# EAGLE design SparkFun_ProtoShield_Kit_rev31 (EAGLE 7.7.0)
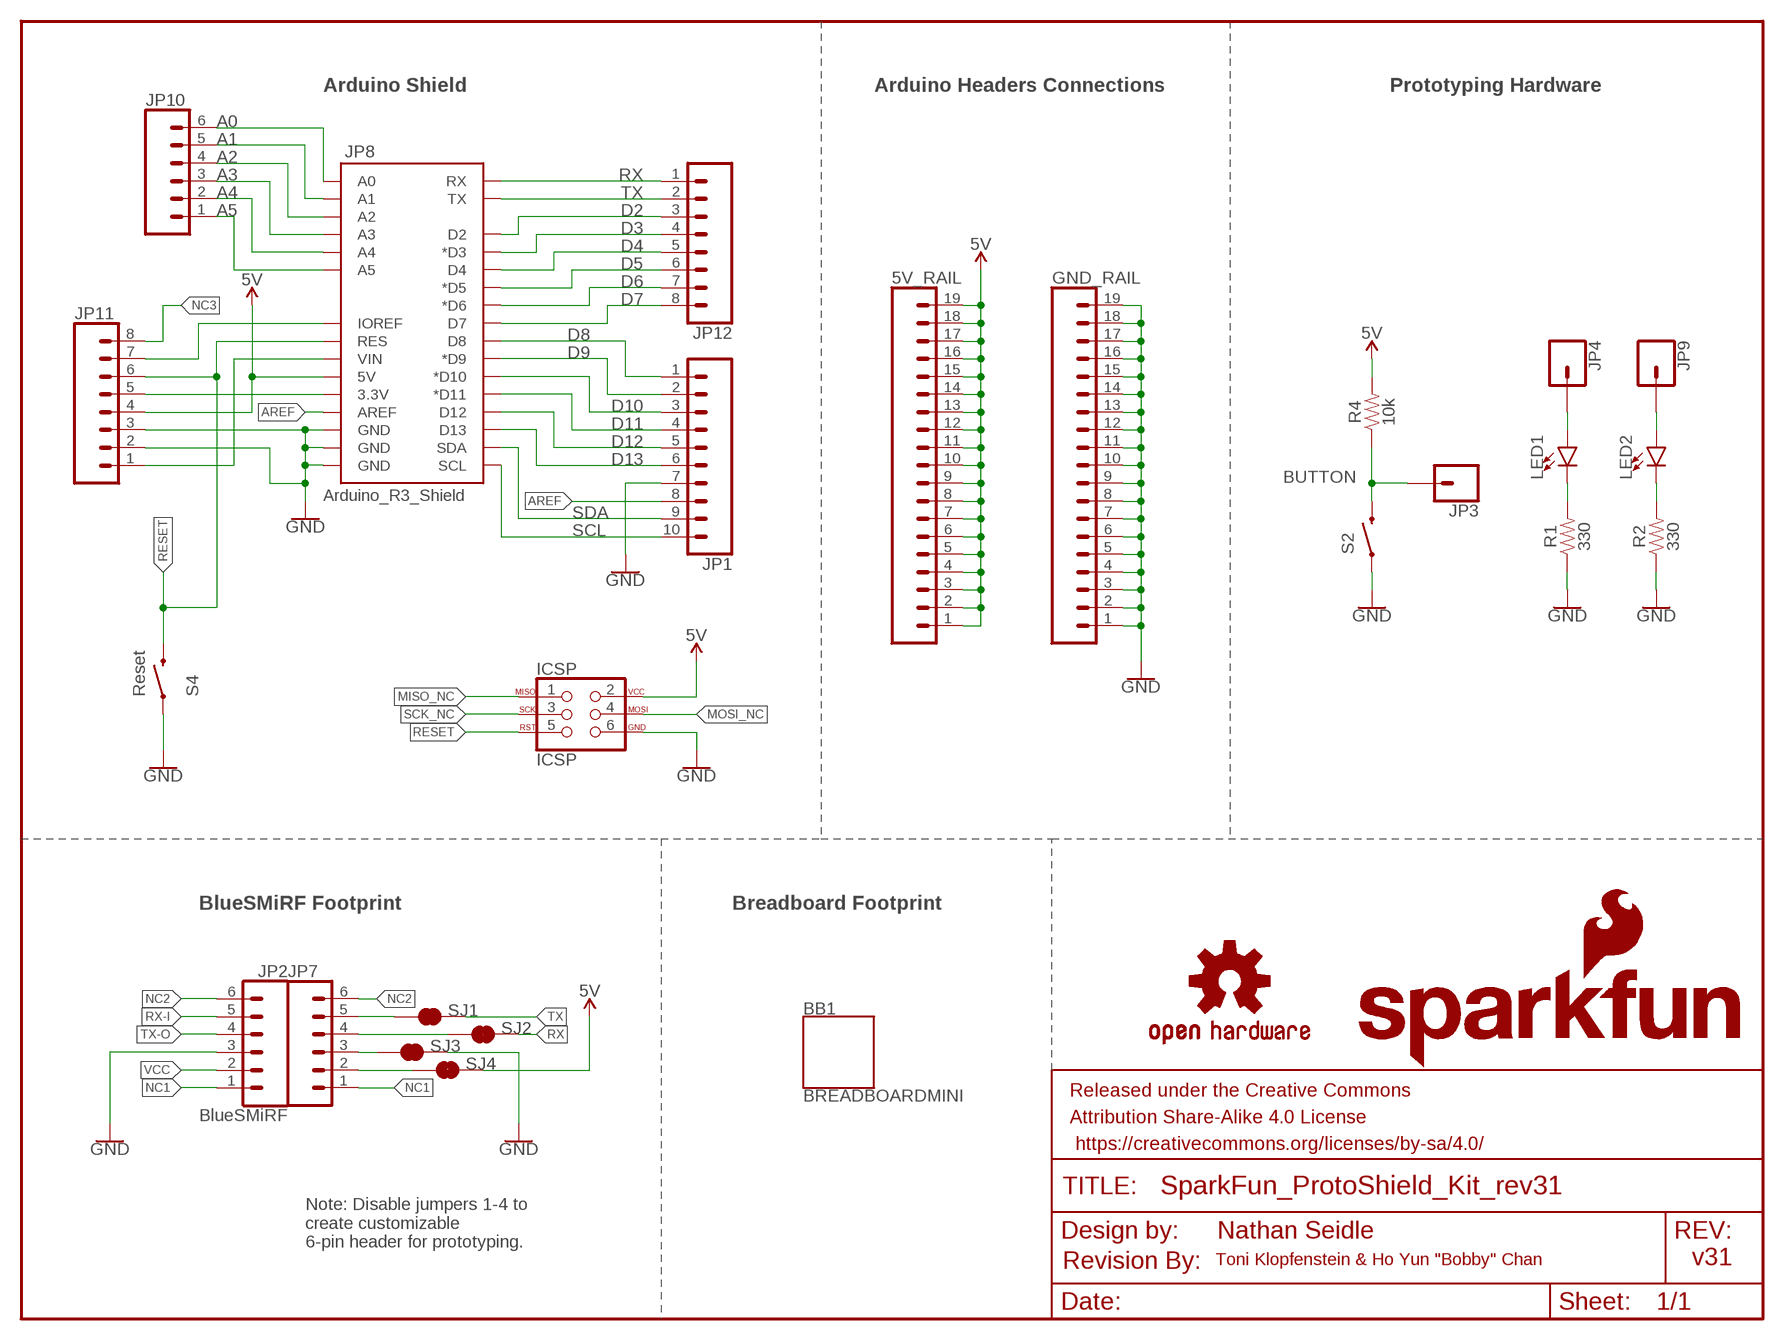
[diagram p0: schematic, sheet 1]

## Parts
5V_RAIL  CONN_19  [1X19]
BB1  BREADBOARDMINI  [BREADBOARD-MINI]
FRAME1  FRAME-LETTER  [CREATIVE_COMMONS]
GND_RAIL  CONN_19  [1X19]
ICSP  ICSP  AVR_SPI_PROG_3X2PTH  [2X3]
JP1  CONN_10"  [1X10]
JP2  BlueSMiRF  CONN_06SILK_FEMALE_PTH  [1X06]
JP3  CONN_01  [1X01]
JP4  CONN_01  [1X01]
JP7  CONN_06SILK_FEMALE_PTH  [1X06]
JP8  ARDUINO_R3_SHIELDR3_PROTO_SHIELD  [UNO_R3_PROTO_SHIELD]
JP9  CONN_01  [1X01]
JP10  CONN_06SILK_FEMALE_PTH  [1X06]
JP11  CONN_08"  [1X08]
JP12  CONN_08"  [1X08]
LED1  LED3MM  [LED_3MM]
LED2  LED3MM  [LED_3MM]
LOGO1  OSHW-LOGOS  [OSHW-LOGO-S]
R1  330  330OHM-HORIZ-1/10W-5%  [AXIAL-0.3]
R2  330  330OHM-HORIZ-1/10W-5%  [AXIAL-0.3]
R4  10k  10KOHM-HORIZ-1/4W-5%  [AXIAL-0.3]
S2  MOMENTARY-SWITCH-SPST-PTH-6.0MM-KIT  [TACTILE_SWITCH_PTH_6.0MM_KIT]
S4  MOMENTARY-SWITCH-SPST-PTH-6.0MM-KIT  [TACTILE_SWITCH_PTH_6.0MM_KIT]
SJ1  JUMPER-SMT_2_NC_TRACE_SILK  [SMT-JUMPER_2_NC_TRACE_SILK]
SJ2  JUMPER-SMT_2_NC_TRACE_SILK  [SMT-JUMPER_2_NC_TRACE_SILK]
SJ3  JUMPER-SMT_2_NC_TRACE_SILK  [SMT-JUMPER_2_NC_TRACE_SILK]
SJ4  JUMPER-SMT_2_NC_TRACE_SILK  [SMT-JUMPER_2_NC_TRACE_SILK]
U$1  SFE_LOGO_NAME_FLAME.1_INCH  [SFE_LOGO_NAME_FLAME_.1]
U$2  REVISION  [REVISION]

## Nets
3.3: JP8.3.3V JP11.5
5V [power]: 5V_RAIL.1 5V_RAIL.2 5V_RAIL.3 5V_RAIL.4 5V_RAIL.5 5V_RAIL.6 5V_RAIL.7 5V_RAIL.8 5V_RAIL.9 5V_RAIL.10 5V_RAIL.11 5V_RAIL.12 5V_RAIL.13 5V_RAIL.14 5V_RAIL.15 5V_RAIL.16 5V_RAIL.17 5V_RAIL.18 5V_RAIL.19 ICSP.2 JP8.5V JP11.4 R4.P$2 SJ4.2
A0: JP8.A0 JP10.6
A1: JP8.A1 JP10.5
A2: JP8.A2 JP10.4
A3: JP8.A3 JP10.3
A4: JP8.A4 JP10.2
A5: JP8.A5 JP10.1
AREF: JP1.8 JP8.AREF
BUTTON: JP3.1 R4.P$1 S2.3
D2: JP8.D2 JP12.3
D3: JP8.D3(*D3) JP12.4
D4: JP8.D4 JP12.5
D5: JP8.D5(*D5) JP12.6
D6: JP8.D6(*D6) JP12.7
D7: JP8.D7 JP12.8
D8: JP1.1 JP8.D8
D9: JP1.2 JP8.D9(*D9)
D10: JP1.3 JP8.D10(*D10)
D11: JP1.4 JP8.D11(*D11)
D12: JP1.5 JP8.D12
D13: JP1.6 JP8.D13
GND [power]: GND_RAIL.1 GND_RAIL.2 GND_RAIL.3 GND_RAIL.4 GND_RAIL.5 GND_RAIL.6 GND_RAIL.7 GND_RAIL.8 GND_RAIL.9 GND_RAIL.10 GND_RAIL.11 GND_RAIL.12 GND_RAIL.13 GND_RAIL.14 GND_RAIL.15 GND_RAIL.16 GND_RAIL.17 GND_RAIL.18 GND_RAIL.19 ICSP.6 JP1.7 JP2.3 JP7.3 JP8.GND@0(GND) JP8.GND@1(GND) JP8.GND@2(GND) JP11.2 JP11.3 R1.P$1 R2.P$1 S2.1 S4.1 SJ3.1 SJ3.2
LED1: JP4.1 LED1.A
LED2: JP9.1 LED2.A
MISO_NC: ICSP.1
MOSI_NC: ICSP.4
N$1: JP8.IOREF JP11.7
N$6: LED1.K(C) R1.P$2
N$7: LED2.K(C) R2.P$2
NC1: JP2.1 JP7.1
NC2: JP2.6 JP7.6
NC3: JP11.8
RESET: ICSP.5 JP8.RES JP11.6 S4.3
RX: JP8.RX JP12.1 SJ2.2
RX-I: JP2.5 JP7.5 SJ1.1
SCK_NC: ICSP.3
SCL: JP1.10 JP8.SCL
SDA: JP1.9 JP8.SDA
TX: JP8.TX JP12.2 SJ1.2
TX-O: JP2.4 JP7.4 SJ2.1
VCC: JP2.2 JP7.2 SJ4.1
VIN: JP8.VIN JP11.1

## Notes on the sheet
- Arduino Shield | Arduino Headers Connections | Prototyping Hardware
- A0
- A1
- A2
- A3
- A4
- A5
- Arduino_R3_Shield
- Reset
- BlueSMiRF Footprint | Breadboard Footprint
- Nathan Seidle
- Note: Disable jumpers 1-4 to 
  create customizable 
  6-pin header for prototyping.
- Toni Klopfenstein & Ho Yun "Bobby" Chan | v31

## Library data of the parts
5V_RAIL GND_RAIL = SparkFun-Connectors:CONN_19: Multi connection point. Often used as Generic Header-pin footprint for 0.1 inch spaced/style header connections On any of the 0.1 inch spaced packages, you can populate with these: Break Away Headers - Straight <https://www.sparkfun.com/products/116> (PRT-00116) Break Away Male Headers - Right Angle <https://www.sparkfun.com/products/553> (PRT-00553) Female Headers <https://www.sparkfun.com/products/115> (PRT-00115) Break Away Headers - Machine Pin <https://www.sparkfun.com/products/117> (PRT-00117) Break Away Female Headers - Swiss Machine Pin <https://www.sparkfun.com/products/743> (PRT-00743) For SCREWTERMINALS and SPRING TERMINALS visit here: Screw Terimnals on SparkFun.com <https://www.sparkfun.com/search/results?term=Screw+Terminals> (5mm/3.5mm/2.54mm spacing) This device is also useful as a general connection point to wire up your design to another part of your project. Our various solder wires solder well into these plated through hole pads. Hook-Up Wire - Assortment (Stranded, 22 AWG) <https://www.sparkfun.com/products/11375> (PRT-11375) Hook-Up Wire - Assortment (Solid Core, 22 AWG) <https://www.sparkfun.com/products/11367> (PRT-11367) View the entire wire category on our website here <https://www.sparkfun.com/categories/141> Special notes: Molex polarized connector foot print use with SKU : PRT-08231 with associated crimp pins and housings. 1MM SMD Version SKU: PRT-10208 NOTES ON THE VARIANTS LOCK and LOCK_LONGPADS... This footprint was designed to help hold the alignment of a through-hole component (i.e. 6-pin header) while soldering it into place. You may notice that each hole has been shifted either up or down by 0.005 of an inch from it's more standard position (which is a perfectly straight line). This slight alteration caused the pins (the squares in the middle) to touch the edges of the holes. Because they are alternating, it causes a "brace" to hold the component in place. 0.005 has proven to be the perfect amount of "off-center" position when using our standard breakaway headers. Although looks a little odd when you look at the bare footprint, once you have a header in there, the alteration is very hard to notice. Also,if you push a header all the way into place, it is covered up entirely on the bottom side.
BB1 = SparkFun-Boards:BREADBOARD: SparkFun Breadboard Mini This is the mechnical outline for the very small self adhesive breadboard from SparkFun Electronics and our prototyping breadboard of the same size. Good for very small proto areas. SparkFun Products: White <https://www.sparkfun.com/products/7916> Green <https://www.sparkfun.com/products/12046> Black <https://www.sparkfun.com/products/12047> Red <https://www.sparkfun.com/products/12044> Blue <https://www.sparkfun.com/products/12045> SparkFun Solder-able Breadboard-Mini <https://www.sparkfun.com/products/12702>; PROD_ID: COMP-12034
FRAME1 = SparkFun-Aesthetics:FRAME-LETTER: Schematic Frame Standard 8.5x11 US Letter frame
ICSP = SparkFun-Connectors:AVR_SPI_PROG_3X2: AVR ISP 6 Pin This is the reduced ISP connector for AVR programming. Common on Arduino. This footprint will take up less PCB space and can be used with a 10-pin to 6-pin adapter such as SKU: BOB-08508 **Special note about "TEST_POINT" package. The stop mask is on the top side, so if you want your programming test points to be on the bottom of your board, make sure to place this package on the bottom side of the board. This also ensure that the orientation to program from the bottom side will be correct. SparkFun Products: SparkFun ISP Pogo Adapter <https://www.sparkfun.com/products/11591> - NS Tiny AVR Programmer <https://www.sparkfun.com/products/11801> -PTH
JP1 = SparkFun-Connectors:CONN_10: Multi connection point. Often used as Generic Header-pin footprint for 0.1 inch spaced/style header connections On any of the 0.1 inch spaced packages, you can populate with these: Break Away Headers - Straight <https://www.sparkfun.com/products/116> (PRT-00116) Break Away Male Headers - Right Angle <https://www.sparkfun.com/products/553> (PRT-00553) Female Headers <https://www.sparkfun.com/products/115> (PRT-00115) Break Away Headers - Machine Pin <https://www.sparkfun.com/products/117> (PRT-00117) Break Away Female Headers - Swiss Machine Pin <https://www.sparkfun.com/products/743> (PRT-00743) Arduino Stackable Header - 10 Pin <https://www.sparkfun.com/products/11376> (PRT-11376) For SCREWTERMINALS and SPRING TERMINALS visit here: Screw Terimnals on SparkFun.com <https://www.sparkfun.com/search/results?term=Screw+Terminals> (5mm/3.5mm/2.54mm spacing) This device is also useful as a general connection point to wire up your design to another part of your project. Our various solder wires solder well into these plated through hole pads. Hook-Up Wire - Assortment (Stranded, 22 AWG) <https://www.sparkfun.com/products/11375> (PRT-11375) Hook-Up Wire - Assortment (Solid Core, 22 AWG) <https://www.sparkfun.com/products/11367> (PRT-11367) View the entire wire category on our website here <https://www.sparkfun.com/categories/141> Special notes: Molex polarized connector foot print use with SKU : PRT-08231 with associated crimp pins and housings. 1MM SMD Version SKU: PRT-10208 NOTES ON THE VARIANTS LOCK and LOCK_LONGPADS... This footprint was designed to help hold the alignment of a through-hole component (i.e. 6-pin header) while soldering it into place. You may notice that each hole has been shifted either up or down by 0.005 of an inch from it's more standard position (which is a perfectly straight line). This slight alteration caused the pins (the squares in the middle) to touch the edges of the holes. Because they are alternating, it causes a "brace" to hold the component in place. 0.005 has proven to be the perfect amount of "off-center" position when using our standard breakaway headers. Although looks a little odd when you look at the bare footprint, once you have a header in there, the alteration is very hard to notice. Also,if you push a header all the way into place, it is covered up entirely on the bottom side.; PROD_ID: CONN-11563
JP2 JP7 JP10 = SparkFun-Connectors:CONN_06: Multi connection point. Often used as Generic Header-pin footprint for 0.1 inch spaced/style header connections On any of the 0.1 inch spaced packages, you can populate with these: Break Away Headers - Straight <https://www.sparkfun.com/products/116> (PRT-00116) Break Away Male Headers - Right Angle <https://www.sparkfun.com/products/553> (PRT-00553) Female Headers <https://www.sparkfun.com/products/115> (PRT-00115) Break Away Headers - Machine Pin <https://www.sparkfun.com/products/117> (PRT-00117) Break Away Female Headers - Swiss Machine Pin <https://www.sparkfun.com/products/743> (PRT-00743) Arduino Stackable Header - 6 Pin <https://www.sparkfun.com/products/9280> (PRT-09280) For SCREWTERMINALS and SPRING TERMINALS visit here: Screw Terimnals on SparkFun.com <https://www.sparkfun.com/search/results?term=Screw+Terminals> (5mm/3.5mm/2.54mm spacing) This device is also useful as a general connection point to wire up your design to another part of your project. Our various solder wires solder well into these plated through hole pads. Hook-Up Wire - Assortment (Stranded, 22 AWG) <https://www.sparkfun.com/products/11375> (PRT-11375) Hook-Up Wire - Assortment (Solid Core, 22 AWG) <https://www.sparkfun.com/products/11367> (PRT-11367) View the entire wire category on our website here <https://www.sparkfun.com/categories/141>; PROD_ID: CONN-08437
JP3 JP4 JP9 = SparkFun-Connectors:CONN_01: Single connection point. Often used as Generic Header-pin footprint for 0.1 inch spaced/style header connections On any of the 0.1 inch spaced packages, you can populate with these: Break Away Headers - Straight <https://www.sparkfun.com/products/116> (PRT-00116) Break Away Male Headers - Right Angle <https://www.sparkfun.com/products/553> (PRT-00553) Female Headers <https://www.sparkfun.com/products/115> (PRT-00115) Break Away Headers - Machine Pin <https://www.sparkfun.com/products/117> (PRT-00117) Break Away Female Headers - Swiss Machine Pin <https://www.sparkfun.com/products/743> (PRT-00743) This device is also useful as a general connection point to wire up your design to another part of your project. Our various solder wires solder well into these plated through hole pads. Hook-Up Wire - Assortment (Stranded, 22 AWG) <https://www.sparkfun.com/products/11375> (PRT-11375) Hook-Up Wire - Assortment (Solid Core, 22 AWG) <https://www.sparkfun.com/products/11367> (PRT-11367) View the entire wire category on our website here <https://www.sparkfun.com/categories/141> Special notes: SMTSO-256-ET is a "flush mount" nut for a 4-40 screw. We mostly use this on specialty testbeds; it is a nice way to connect hardware to your PCB at an adjustable hieght. Also note, the SNAP packages are for using a snappable style connector. We sell a baggie of snaps and they are also used on two LilyPad designs: Snap Assortment - 30 pack (male and female) <https://www.sparkfun.com/products/11347> (DEV-11347) LilyPad Arduino SimpleSnap <https://www.sparkfun.com/products/10941> (DEV-10941) LilyPad SimpleSnap Protoboard <https://www.sparkfun.com/products/10940> (DEV-10940)
JP8 = TempLibrary:ARDUINO_R3_SHIELD: Shield form compatible with the Arduino Uno R3.
JP11 JP12 = SparkFun-Connectors:CONN_08: Multi connection point. Often used as Generic Header-pin footprint for 0.1 inch spaced/style header connections On any of the 0.1 inch spaced packages, you can populate with these: Break Away Headers - Straight <https://www.sparkfun.com/products/116> (PRT-00116) Break Away Male Headers - Right Angle <https://www.sparkfun.com/products/553> (PRT-00553) Female Headers <https://www.sparkfun.com/products/115> (PRT-00115) Break Away Headers - Machine Pin <https://www.sparkfun.com/products/117> (PRT-00117) Break Away Female Headers - Swiss Machine Pin <https://www.sparkfun.com/products/743> (PRT-00743) Arduino Stackable Header - 8 Pin <https://www.sparkfun.com/products/9279> (PRT-09279) For SCREWTERMINALS and SPRING TERMINALS visit here: Screw Terimnals on SparkFun.com <https://www.sparkfun.com/search/results?term=Screw+Terminals> (5mm/3.5mm/2.54mm spacing) This device is also useful as a general connection point to wire up your design to another part of your project. Our various solder wires solder well into these plated through hole pads. Hook-Up Wire - Assortment (Stranded, 22 AWG) <https://www.sparkfun.com/products/11375> (PRT-11375) Hook-Up Wire - Assortment (Solid Core, 22 AWG) <https://www.sparkfun.com/products/11367> (PRT-11367) View the entire wire category on our website here <https://www.sparkfun.com/categories/141> Special notes: Molex polarized connector foot print use with SKU : PRT-08231 with associated crimp pins and housings. 1MM SMD Version SKU: PRT-10208 NOTES ON THE VARIANTS LOCK and LOCK_LONGPADS... This footprint was designed to help hold the alignment of a through-hole component (i.e. 6-pin header) while soldering it into place. You may notice that each hole has been shifted either up or down by 0.005 of an inch from it's more standard position (which is a perfectly straight line). This slight alteration caused the pins (the squares in the middle) to touch the edges of the holes. Because they are alternating, it causes a "brace" to hold the component in place. 0.005 has proven to be the perfect amount of "off-center" position when using our standard breakaway headers. Although looks a little odd when you look at the bare footprint, once you have a header in there, the alteration is very hard to notice. Also,if you push a header all the way into place, it is covered up entirely on the bottom side.; PROD_ID: CONN-08438
LED1 LED2 = SparkFun-LED:LED: LED (Generic) Standard schematic elements and footprints for 5mm, 3mm, 1206, and 0603 sized LEDs. Generic LEDs with no color specified.; PROD_ID: DIO-08794
LOGO1 = SparkFun-Aesthetics:OSHW-LOGO: Open-Source Hardware (OSHW) Logo This logo indicates the piece of hardware it is found on incorporates a OSHW license and/or adheres to the definition of open source hardware found here: http://freedomdefined.org/OSHW
R1 R2 = SparkFun-Resistors:330OHM: 330Ω resistor A resistor is a passive two-terminal electrical component that implements electrical resistance as a circuit element. Resistors act to reduce current flow, and, at the same time, act to lower voltage levels within circuits. - Wikipedia; PROD_ID: RES-8371
R4 = SparkFun-Resistors:10KOHM: 10kΩ resistor A resistor is a passive two-terminal electrical component that implements electrical resistance as a circuit element. Resistors act to reduce current flow, and, at the same time, act to lower voltage levels within circuits. - Wikipedia; PROD_ID: RES-09435
S2 S4 = SparkFun-Switches:MOMENTARY-SWITCH-SPST: Momentary Switch (Pushbutton) - SPST Normally-open (NO) SPST momentary switches (buttons, pushbuttons). Variants PTH-12MM - 12mm square, through-hole Momentary Pushbutton Switch - 12mm Square <https://www.sparkfun.com/products/9190> (COM-09190) PTH-6.0MM, PTH-6.0MM-KIT - 6.0mm square, through-hole Mini Pushbutton Switch <https://www.sparkfun.com/products/97> (COM-00097) KIT package intended for soldering kit's - only one side of pads' copper is exposed. PTH-RIGHT-ANGLE-KIT - Right-angle, through-hole Right Angle Tactile Button <https://www.sparkfun.com/products/10791> - Used on SparkFun BigTime Watch Kit <https://www.sparkfun.com/products/11734> SMD-12MM - 12mm square, surface-mount Tactile Button - SMD (12mm) <https://www.sparkfun.com/products/12993> (COM-12993) Used on SparkFun PicoBoard <https://www.sparkfun.com/products/11888> SMD-4.5MM - 4.5mm Square Trackball Switch Used on SparkFun Blackberry Trackballer Breakout <https://www.sparkfun.com/products/13169> SMD-4.6MMX2.8MM - 4.60mm x 2.80mm, surface mount Used on SparkFun SAMD21 Mini Breakout <https://www.sparkfun.com/products/13664> SMD-5.2MM, SMD-5.2-REDUNDANT - 5.2mm square, surface-mount Mini Pushbutton Switch - SMD <https://www.sparkfun.com/products/8720> (COM-08720) Used on Arduino Pro Mini <https://www.sparkfun.com/products/11114> REDUNDANT package connects both switch circuits together SMD-6.0X3.5MM - 6.0 x 3.5mm, surface mount Momentary Reset Switch SMD <https://www.sparkfun.com/products/8229> (COM-08229) SMD-6.2MM-TALL - 6.2mm square, surface mount Tactile Button - SMD (6mm) <https://www.sparkfun.com/products/12992> Used on SparkFun Digital Sandbox <https://www.sparkfun.com/products/12651> SMD-RIGHT-ANGLE - Right-angle, surface mount Used on SparkFun Block for Intel® Edison - Arduino <https://www.sparkfun.com/products/13036>; PROD_ID: SWCH-08441; SF_SKU: COM-00097
SJ1-SJ4 = SparkFun-Jumpers:JUMPER-SMT_2_NC_TRACE: Normally closed trace jumper This jumper has a trace between two pads so it's normally closed (NC). Use a razor knife to open the connection. For best results follow the IPC guidelines for cutting traces: Cutout at least 0.063 mm (0.005 in). Remove all loose material to clean up the cut area. Seal the cut with an approved epoxy. Reapply solder to reclose the connection.
U$1 = SparkFun-Aesthetics:SFE_LOGO_NAME_FLAME: SparkFun Font Logo w/ Flame This is the SparkFun full logo. The logo on the schematic will always be the same size; the package variant is the height of the flame part of the logo. Default layer for the logo on the board is tSilk.
U$2 = SparkFun-Aesthetics:REVISION

## Net classes
1 power: width 0.254 mm

## Board
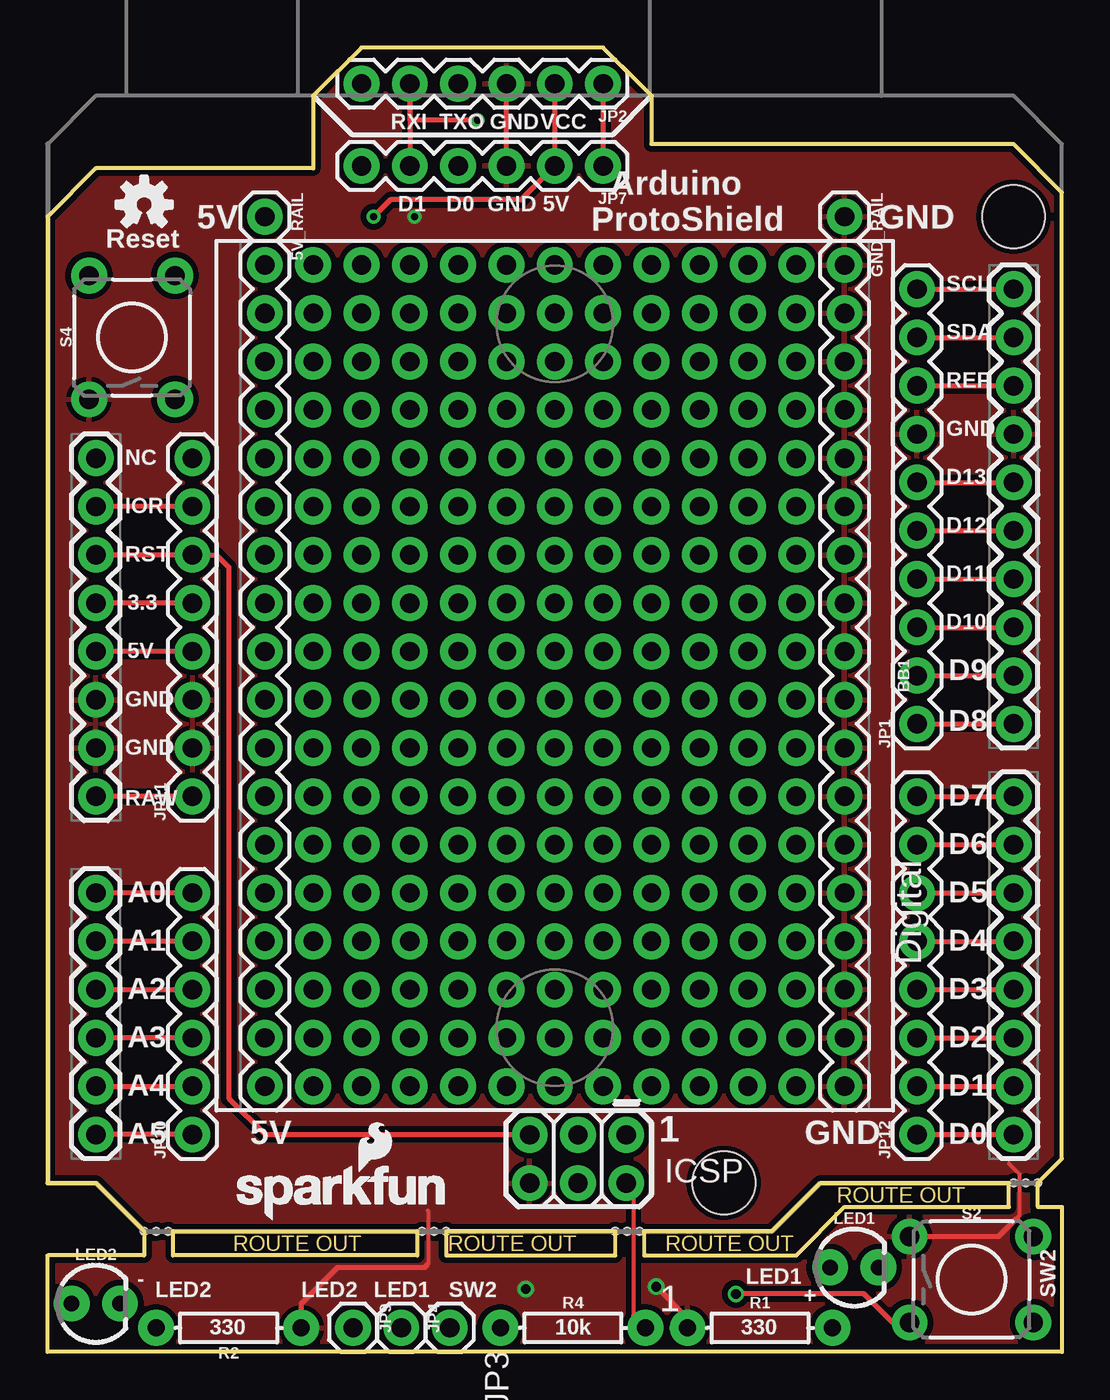
[diagram p1: board, top side]
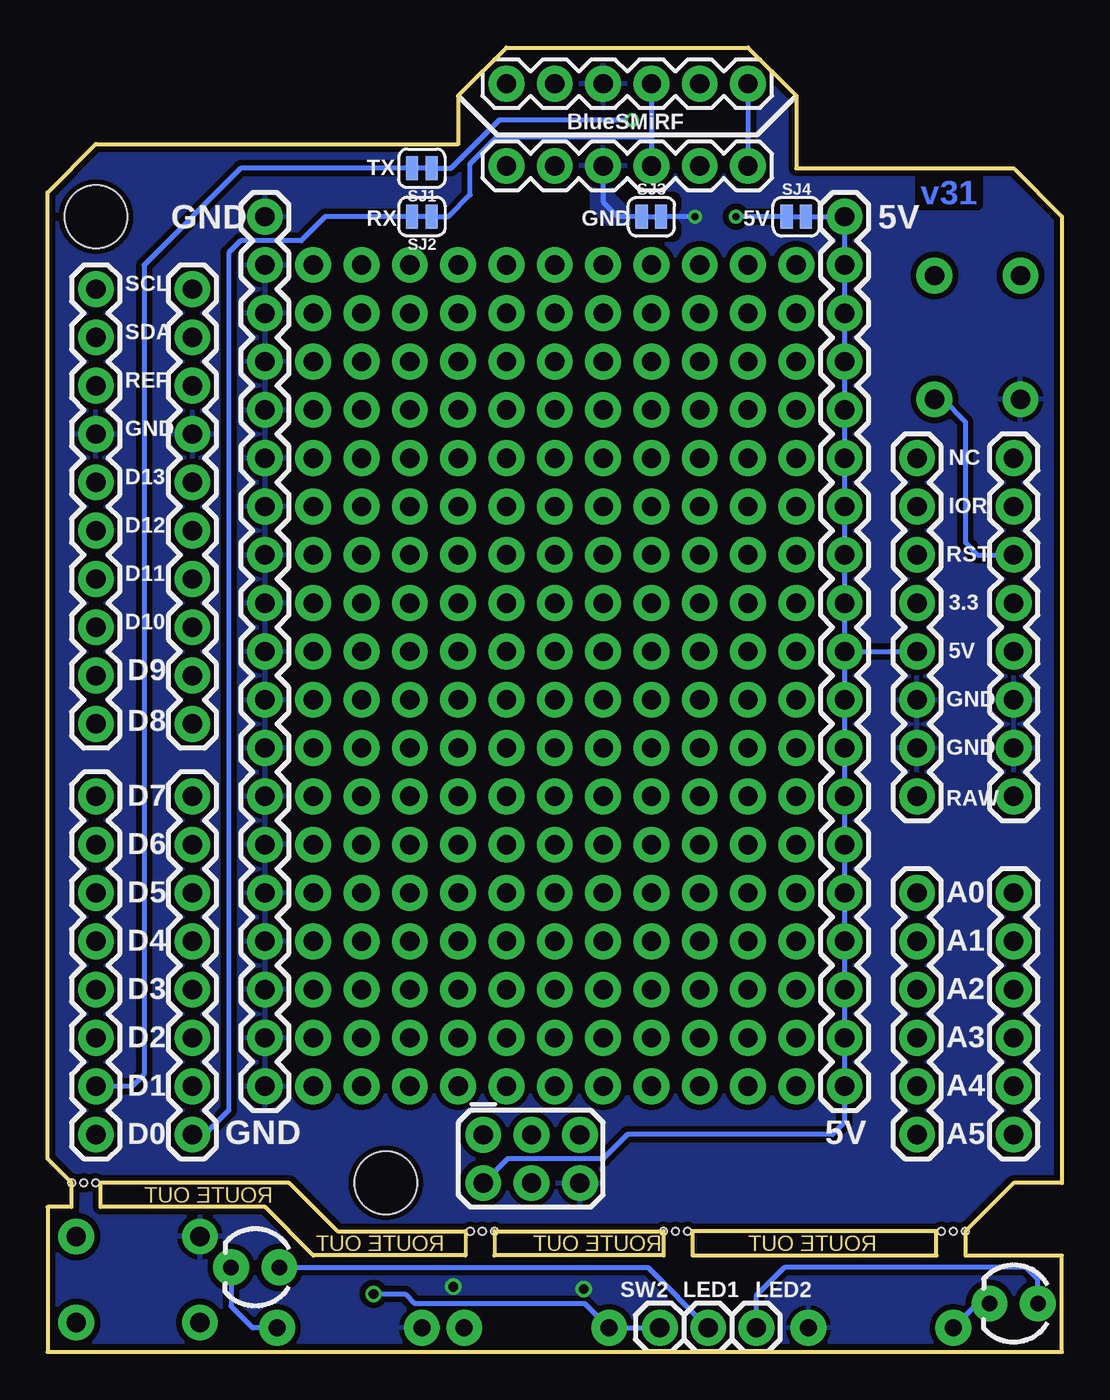
[diagram p2: board, bottom side, seen from below]

Size 53.34 x 68.58 mm. Coordinates in mm from the lower left corner, seen from the top.
Copper layers (1*16): Top 0.035mm / dielectric 1.5mm / Bottom 0.035mm
Design rules "SparkFun-2-layer-TIGHT": minimum track width 7mil, minimum drill 15mil, track to track 7mil, track to pad 7mil, pad to pad 7mil, via to via 7mil, smd to smd 7mil, copper to edge 7mil, drill to drill 7mil, minimum pad ring 7mil, minimum via ring 7mil, stop-mask expansion 4mil, vias tented up to drill 20mil, thermal gap 10mil
Holes 0.38 mm at 5.08,6.35 5.71,6.35 6.35,6.35 19.68,6.35 20.32,6.35 20.95,6.35 50.8,8.89 52.07,8.89 51.44,8.89 29.84,6.35 30.48,6.35 31.11,6.35
tRestrict: 5 lines
bRestrict: 12 lines

### Footprints (pad centres in the part's own frame; a part is rotated, then mirrored left to right if it is on the bottom)
1X19 = drill 1.016 pad 1.88: 1 0,0; 2 2.54,0; 3 5.08,0; 4 7.62,0; 5 10.16,0; 6 12.7,0; 7 15.24,0; 8 17.78,0; 9 20.32,0; 10 22.86,0; 11 25.4,0; 12 27.94,0; 13 30.48,0; 14 33.02,0; 15 35.56,0; 16 38.1,0; 17 40.64,0; 18 43.18,0; 19 45.72,0
2X3 = drill 1.016 pad 1.88: 1 0,0; 2 0,2.54; 3 2.54,0; 4 2.54,2.54; 5 5.08,0; 6 5.08,2.54
1X10 = drill 1.016 pad 1.88: 1 0,0; 2 2.54,0; 3 5.08,0; 4 7.62,0; 5 10.16,0; 6 12.7,0; 7 15.24,0; 8 17.78,0; 9 20.32,0; 10 22.86,0
1X06 = drill 1.016 pad 1.88: 1 0,0; 2 2.54,0; 3 5.08,0; 4 7.62,0; 5 10.16,0; 6 12.7,0
1X01 = drill 1.016 pad 1.88: 1 0,0
UNO_R3_PROTO_SHIELD = drill 1.016 pad 1.88: 3.3V 50.8,26.67; 5V 50.8,29.21; A0 50.8,41.91; A1 50.8,44.45; A2 50.8,46.99; A3 50.8,49.53; A4 50.8,52.07; A5 50.8,54.61; AREF 2.54,15.24; D2 2.54,49.53; D3 2.54,46.99; D4 2.54,44.45; D5 2.54,41.91; D6 2.54,39.37; D7 2.54,36.83; D8 2.54,33.02; D9 2.54,30.48; D10 2.54,27.94; D11 2.54,25.4; D12 2.54,22.86; D13 2.54,20.32; GND@0 50.8,31.75; GND@1 50.8,34.29; GND@2 2.54,17.78; IOREF 50.8,21.59; NC 50.8,19.05; RES 50.8,24.13; RX 2.54,54.61; SCL 2.54,10.16; SDA 2.54,12.7; TX 2.54,52.07; VIN 50.8,36.83 | hole 3.302: 2.54,6.35; 17.78,57.15
1X08 = drill 1.016 pad 1.88: 1 0,0; 2 2.54,0; 3 5.08,0; 4 7.62,0; 5 10.16,0; 6 12.7,0; 7 15.24,0; 8 17.78,0
LED_3MM = drill 0.813 pad 1.88: A -1.27,0; K 1.27,0
AXIAL-0.3 = drill 0.9 pad 1.88: P$1 -3.81,0; P$2 3.81,0
TACTILE_SWITCH_PTH_6.0MM_KIT = drill 1.016 pad 1.88: 1 -3.251,2.261; 2 3.251,2.261; 3 -3.251,-2.261; 4 3.251,-2.261
SMT-JUMPER_2_NC_TRACE_SILK = smd 0.635 x 1.27: 1 -0.508,0; 2 0.508,0

### Placement (x,y rotation side)
5V_RAIL  11.43,59.69 270 top
BB1  26.67,35.56 270 top
FRAME1  1.8,-14.61 0 top  (outside the outline)
GND_RAIL  41.91,59.69 270 top
ICSP  30.43,11.42 180 top
JP1  45.72,33.02 90 top
JP2  29.21,66.67 180 top
JP3  21.15,1.27 270 top
JP4  18.61,1.27 270 top
JP7  29.21,62.36 180 top
JP8  53.34,66.04 180 top
JP9  16.07,1.27 270 top
JP10  7.62,11.43 90 top
JP11  7.62,29.21 90 top
JP12  45.72,11.43 90 top
LED1  42.42,4.45 0 top
LED2  2.54,2.54 0 top
LOGO1  5.08,60.33 0 top
R1  37.47,1.27 0 top
R2  9.53,1.27 180 top
R4  27.62,1.27 0 top
S2  48.58,3.81 0 top
S4  4.45,53.34 90 top
SJ1  33.66,62.23 180 bottom
SJ2  33.66,59.69 180 bottom
SJ3  21.59,59.69 0 bottom
SJ4  13.97,59.69 0 bottom
U$1  9.53,6.86 0 top
U$2  13.34,-17.14 0 top  (outside the outline)

### Tracks (layer width: path | path; a pad name or v marks a point on that pad's centre or on a via)
3.3
  Top 0.254: JP11.5 JP8.3.3V
5V
  Top 0.203: ICSP.2 30.8,8.51 30.8,1.91 R4.P$2
  Top 0.254: JP11.4 JP8.5V
  Bottom 0.254: 5V_RAIL.10 5V_RAIL.9 5V_RAIL.8 5V_RAIL.7 5V_RAIL.6 5V_RAIL.5 5V_RAIL.4 5V_RAIL.3 5V_RAIL.2 5V_RAIL.1 SJ4.2 | 5V_RAIL.10 JP11.4 | 5V_RAIL.10 5V_RAIL.11 5V_RAIL.12 5V_RAIL.13 5V_RAIL.14 5V_RAIL.15 5V_RAIL.16 5V_RAIL.17 5V_RAIL.18 5V_RAIL.19 11.43,12.06 12.06,11.43 22.86,11.43 24.13,10.16 29.15,10.16 ICSP.2
A0
  Top 0.254: JP10.6 JP8.A0
A1
  Top 0.254: JP10.5 JP8.A1
A2
  Top 0.254: JP8.A2 JP10.4
A3
  Top 0.254: JP10.3 JP8.A3
A4
  Top 0.254: JP8.A4 JP10.2
A5
  Top 0.254: JP10.1 JP8.A5
AREF
  Top 0.254: JP1.8 JP8.AREF
BUTTON  (via drill 0.51)
  Top 0.254: S2.3 44.42,1.55 42.93,3.05 v36.2,3.05
  Bottom 0.254: v36.2,3.05 34.54,3.05 34.04,2.54 25.08,2.54 R4.P$1 JP3.1
D2
  Top 0.254: JP12.3 JP8.D2
D3
  Top 0.254: JP12.4 JP8.D3
D4
  Top 0.254: JP12.5 JP8.D4
D5
  Top 0.254: JP12.6 JP8.D5
D6
  Top 0.254: JP12.7 JP8.D6
D7
  Top 0.254: JP12.8 JP8.D7
D8
  Top 0.254: JP1.1 JP8.D8
D9
  Top 0.254: JP1.2 JP8.D9
D10
  Top 0.254: JP1.3 JP8.D10
D11
  Top 0.254: JP1.4 JP8.D11
D12
  Top 0.254: JP1.5 JP8.D12
D13
  Top 0.254: JP1.6 JP8.D13
GND  (via drill 0.38, 0.51)
  Top 0.203: 20,7.43 20,4.64 | 50.99,7.05 51.12,7.18 51.12,9.34 50.55,9.91
  Top 0.254: R2.P$1 13.34,2.54 15.24,4.45 19.81,4.45 20,4.64 | S2.1 50.01,6.07 50.99,7.05 | v32,3.43 33.66,1.78 R1.P$1 | JP7.3 JP2.3
  Bottom 0.254: v19.3,59.69 SJ3.2 | SJ3.1 23.37,59.69 24.13,60.45 JP7.3
  other vias: 25.15,3.3
  pour Top (isolate 0.305): 53.34,0 0,0 0,68.58 53.34,68.58
  pour Bottom (isolate 0.305): 53.34,0 0,0 0,68.58 53.34,68.58
LED1
  Bottom 0.254: LED1.A 21.78,4.45 JP4.1
LED2
  Bottom 0.254: LED2.A 1.27,3.81 1.91,4.45 14.61,4.45 16.07,2.98 JP9.1
N$1
  Top 0.254: JP11.7 JP8.IOREF
N$3  (via drill 1.02 pad 1.88)
  other vias: 39.37,13.97
N$4  (via drill 1.02 pad 1.88)
  other vias: 36.83,13.97
N$5  (via drill 1.02 pad 1.88)
  other vias: 13.97,13.97
N$6
  Bottom 0.254: R1.P$2 42.55,1.27 43.69,2.41 LED1.K
N$7
  Bottom 0.254: LED2.K 4.45,2.54 R2.P$2
N$10  (via drill 1.02 pad 1.88)
  other vias: 16.51,13.97
N$11  (via drill 1.02 pad 1.88)
  other vias: 19.05,13.97
N$12  (via drill 1.02 pad 1.88)
  other vias: 21.59,13.97
N$13  (via drill 1.02 pad 1.88)
  other vias: 24.13,13.97
N$14  (via drill 1.02 pad 1.88)
  other vias: 26.67,13.97
N$15  (via drill 1.02 pad 1.88)
  other vias: 29.21,13.97
N$16  (via drill 1.02 pad 1.88)
  other vias: 31.75,13.97
N$17  (via drill 1.02 pad 1.88)
  other vias: 34.29,13.97
N$18  (via drill 1.02 pad 1.88)
  other vias: 39.37,16.51
N$19  (via drill 1.02 pad 1.88)
  other vias: 36.83,16.51
N$20  (via drill 1.02 pad 1.88)
  other vias: 13.97,16.51
N$21  (via drill 1.02 pad 1.88)
  other vias: 16.51,16.51
N$22  (via drill 1.02 pad 1.88)
  other vias: 19.05,16.51
N$23  (via drill 1.02 pad 1.88)
  other vias: 21.59,16.51
N$24  (via drill 1.02 pad 1.88)
  other vias: 24.13,16.51
N$25  (via drill 1.02 pad 1.88)
  other vias: 26.67,16.51
N$26  (via drill 1.02 pad 1.88)
  other vias: 29.21,16.51
N$27  (via drill 1.02 pad 1.88)
  other vias: 31.75,16.51
N$28  (via drill 1.02 pad 1.88)
  other vias: 34.29,16.51
N$29  (via drill 1.02 pad 1.88)
  other vias: 39.37,19.05
N$30  (via drill 1.02 pad 1.88)
  other vias: 36.83,19.05
N$31  (via drill 1.02 pad 1.88)
  other vias: 13.97,19.05
N$32  (via drill 1.02 pad 1.88)
  other vias: 16.51,19.05
N$33  (via drill 1.02 pad 1.88)
  other vias: 19.05,19.05
N$34  (via drill 1.02 pad 1.88)
  other vias: 21.59,19.05
N$35  (via drill 1.02 pad 1.88)
  other vias: 24.13,19.05
N$36  (via drill 1.02 pad 1.88)
  other vias: 26.67,19.05
N$37  (via drill 1.02 pad 1.88)
  other vias: 29.21,19.05
N$38  (via drill 1.02 pad 1.88)
  other vias: 31.75,19.05
N$39  (via drill 1.02 pad 1.88)
  other vias: 34.29,19.05
N$40  (via drill 1.02 pad 1.88)
  other vias: 39.37,21.59
N$41  (via drill 1.02 pad 1.88)
  other vias: 36.83,21.59
N$42  (via drill 1.02 pad 1.88)
  other vias: 13.97,21.59
N$43  (via drill 1.02 pad 1.88)
  other vias: 16.51,21.59
N$44  (via drill 1.02 pad 1.88)
  other vias: 19.05,21.59
N$45  (via drill 1.02 pad 1.88)
  other vias: 21.59,21.59
N$46  (via drill 1.02 pad 1.88)
  other vias: 24.13,21.59
N$47  (via drill 1.02 pad 1.88)
  other vias: 26.67,21.59
N$48  (via drill 1.02 pad 1.88)
  other vias: 29.21,21.59
N$49  (via drill 1.02 pad 1.88)
  other vias: 31.75,21.59
N$50  (via drill 1.02 pad 1.88)
  other vias: 34.29,21.59
N$51  (via drill 1.02 pad 1.88)
  other vias: 39.37,24.13
N$52  (via drill 1.02 pad 1.88)
  other vias: 36.83,24.13
N$53  (via drill 1.02 pad 1.88)
  other vias: 13.97,24.13
N$54  (via drill 1.02 pad 1.88)
  other vias: 16.51,24.13
N$55  (via drill 1.02 pad 1.88)
  other vias: 19.05,24.13
N$56  (via drill 1.02 pad 1.88)
  other vias: 21.59,24.13
N$57  (via drill 1.02 pad 1.88)
  other vias: 24.13,24.13
N$58  (via drill 1.02 pad 1.88)
  other vias: 26.67,24.13
N$59  (via drill 1.02 pad 1.88)
  other vias: 29.21,24.13
N$60  (via drill 1.02 pad 1.88)
  other vias: 31.75,24.13
N$61  (via drill 1.02 pad 1.88)
  other vias: 34.29,24.13
N$62  (via drill 1.02 pad 1.88)
  other vias: 39.37,26.67
N$63  (via drill 1.02 pad 1.88)
  other vias: 36.83,26.67
N$64  (via drill 1.02 pad 1.88)
  other vias: 13.97,26.67
N$65  (via drill 1.02 pad 1.88)
  other vias: 16.51,26.67
N$66  (via drill 1.02 pad 1.88)
  other vias: 19.05,26.67
N$67  (via drill 1.02 pad 1.88)
  other vias: 21.59,26.67
N$68  (via drill 1.02 pad 1.88)
  other vias: 24.13,26.67
N$69  (via drill 1.02 pad 1.88)
  other vias: 26.67,26.67
N$70  (via drill 1.02 pad 1.88)
  other vias: 29.21,26.67
N$71  (via drill 1.02 pad 1.88)
  other vias: 31.75,26.67
N$72  (via drill 1.02 pad 1.88)
  other vias: 34.29,26.67
N$73  (via drill 1.02 pad 1.88)
  other vias: 39.37,29.21
N$74  (via drill 1.02 pad 1.88)
  other vias: 36.83,29.21
N$75  (via drill 1.02 pad 1.88)
  other vias: 13.97,29.21
N$76  (via drill 1.02 pad 1.88)
  other vias: 16.51,29.21
N$77  (via drill 1.02 pad 1.88)
  other vias: 19.05,29.21
N$78  (via drill 1.02 pad 1.88)
  other vias: 21.59,29.21
N$79  (via drill 1.02 pad 1.88)
  other vias: 24.13,29.21
N$80  (via drill 1.02 pad 1.88)
  other vias: 26.67,29.21
N$81  (via drill 1.02 pad 1.88)
  other vias: 29.21,29.21
N$82  (via drill 1.02 pad 1.88)
  other vias: 31.75,29.21
N$83  (via drill 1.02 pad 1.88)
  other vias: 34.29,29.21
N$84  (via drill 1.02 pad 1.88)
  other vias: 39.37,31.75
N$85  (via drill 1.02 pad 1.88)
  other vias: 36.83,31.75
N$86  (via drill 1.02 pad 1.88)
  other vias: 13.97,31.75
N$87  (via drill 1.02 pad 1.88)
  other vias: 16.51,31.75
N$88  (via drill 1.02 pad 1.88)
  other vias: 19.05,31.75
N$89  (via drill 1.02 pad 1.88)
  other vias: 21.59,31.75
N$90  (via drill 1.02 pad 1.88)
  other vias: 24.13,31.75
N$91  (via drill 1.02 pad 1.88)
  other vias: 26.67,31.75
N$92  (via drill 1.02 pad 1.88)
  other vias: 29.21,31.75
N$93  (via drill 1.02 pad 1.88)
  other vias: 31.75,31.75
N$94  (via drill 1.02 pad 1.88)
  other vias: 34.29,31.75
N$95  (via drill 1.02 pad 1.88)
  other vias: 39.37,34.29
N$96  (via drill 1.02 pad 1.88)
  other vias: 36.83,34.29
N$97  (via drill 1.02 pad 1.88)
  other vias: 13.97,34.29
N$98  (via drill 1.02 pad 1.88)
  other vias: 16.51,34.29
N$99  (via drill 1.02 pad 1.88)
  other vias: 19.05,34.29
N$100  (via drill 1.02 pad 1.88)
  other vias: 21.59,34.29
N$101  (via drill 1.02 pad 1.88)
  other vias: 24.13,34.29
N$102  (via drill 1.02 pad 1.88)
  other vias: 26.67,34.29
N$103  (via drill 1.02 pad 1.88)
  other vias: 29.21,34.29
N$104  (via drill 1.02 pad 1.88)
  other vias: 31.75,34.29
N$105  (via drill 1.02 pad 1.88)
  other vias: 34.29,34.29
N$106  (via drill 1.02 pad 1.88)
  other vias: 39.37,36.83
N$107  (via drill 1.02 pad 1.88)
  other vias: 36.83,36.83
N$108  (via drill 1.02 pad 1.88)
  other vias: 13.97,36.83
N$109  (via drill 1.02 pad 1.88)
  other vias: 16.51,36.83
N$110  (via drill 1.02 pad 1.88)
  other vias: 19.05,36.83
N$111  (via drill 1.02 pad 1.88)
  other vias: 21.59,36.83
N$112  (via drill 1.02 pad 1.88)
  other vias: 24.13,36.83
N$113  (via drill 1.02 pad 1.88)
  other vias: 26.67,36.83
N$114  (via drill 1.02 pad 1.88)
  other vias: 29.21,36.83
N$115  (via drill 1.02 pad 1.88)
  other vias: 31.75,36.83
N$116  (via drill 1.02 pad 1.88)
  other vias: 34.29,36.83
N$117  (via drill 1.02 pad 1.88)
  other vias: 39.37,39.37
N$118  (via drill 1.02 pad 1.88)
  other vias: 36.83,39.37
N$119  (via drill 1.02 pad 1.88)
  other vias: 13.97,39.37
N$120  (via drill 1.02 pad 1.88)
  other vias: 16.51,39.37
N$121  (via drill 1.02 pad 1.88)
  other vias: 19.05,39.37
N$122  (via drill 1.02 pad 1.88)
  other vias: 21.59,39.37
N$123  (via drill 1.02 pad 1.88)
  other vias: 24.13,39.37
N$124  (via drill 1.02 pad 1.88)
  other vias: 26.67,39.37
N$125  (via drill 1.02 pad 1.88)
  other vias: 29.21,39.37
N$126  (via drill 1.02 pad 1.88)
  other vias: 31.75,39.37
N$127  (via drill 1.02 pad 1.88)
  other vias: 34.29,39.37
N$128  (via drill 1.02 pad 1.88)
  other vias: 39.37,41.91
N$129  (via drill 1.02 pad 1.88)
  other vias: 36.83,41.91
N$130  (via drill 1.02 pad 1.88)
  other vias: 13.97,41.91
N$131  (via drill 1.02 pad 1.88)
  other vias: 16.51,41.91
N$132  (via drill 1.02 pad 1.88)
  other vias: 19.05,41.91
N$133  (via drill 1.02 pad 1.88)
  other vias: 21.59,41.91
N$134  (via drill 1.02 pad 1.88)
  other vias: 24.13,41.91
N$135  (via drill 1.02 pad 1.88)
  other vias: 26.67,41.91
N$136  (via drill 1.02 pad 1.88)
  other vias: 29.21,41.91
N$137  (via drill 1.02 pad 1.88)
  other vias: 31.75,41.91
N$138  (via drill 1.02 pad 1.88)
  other vias: 34.29,41.91
N$139  (via drill 1.02 pad 1.88)
  other vias: 39.37,44.45
N$140  (via drill 1.02 pad 1.88)
  other vias: 36.83,44.45
N$141  (via drill 1.02 pad 1.88)
  other vias: 13.97,44.45
N$142  (via drill 1.02 pad 1.88)
  other vias: 16.51,44.45
N$143  (via drill 1.02 pad 1.88)
  other vias: 19.05,44.45
N$144  (via drill 1.02 pad 1.88)
  other vias: 21.59,44.45
N$145  (via drill 1.02 pad 1.88)
  other vias: 24.13,44.45
N$146  (via drill 1.02 pad 1.88)
  other vias: 26.67,44.45
N$147  (via drill 1.02 pad 1.88)
  other vias: 29.21,44.45
N$148  (via drill 1.02 pad 1.88)
  other vias: 31.75,44.45
N$149  (via drill 1.02 pad 1.88)
  other vias: 34.29,44.45
N$150  (via drill 1.02 pad 1.88)
  other vias: 39.37,46.99
N$151  (via drill 1.02 pad 1.88)
  other vias: 36.83,46.99
N$152  (via drill 1.02 pad 1.88)
  other vias: 13.97,46.99
N$153  (via drill 1.02 pad 1.88)
  other vias: 16.51,46.99
N$154  (via drill 1.02 pad 1.88)
  other vias: 19.05,46.99
N$155  (via drill 1.02 pad 1.88)
  other vias: 21.59,46.99
N$156  (via drill 1.02 pad 1.88)
  other vias: 24.13,46.99
N$157  (via drill 1.02 pad 1.88)
  other vias: 26.67,46.99
N$158  (via drill 1.02 pad 1.88)
  other vias: 29.21,46.99
N$159  (via drill 1.02 pad 1.88)
  other vias: 31.75,46.99
N$160  (via drill 1.02 pad 1.88)
  other vias: 34.29,46.99
N$161  (via drill 1.02 pad 1.88)
  other vias: 39.37,49.53
N$162  (via drill 1.02 pad 1.88)
  other vias: 36.83,49.53
N$163  (via drill 1.02 pad 1.88)
  other vias: 13.97,49.53
N$164  (via drill 1.02 pad 1.88)
  other vias: 16.51,49.53
N$165  (via drill 1.02 pad 1.88)
  other vias: 19.05,49.53
N$166  (via drill 1.02 pad 1.88)
  other vias: 21.59,49.53
N$167  (via drill 1.02 pad 1.88)
  other vias: 24.13,49.53
N$168  (via drill 1.02 pad 1.88)
  other vias: 26.67,49.53
N$169  (via drill 1.02 pad 1.88)
  other vias: 29.21,49.53
N$170  (via drill 1.02 pad 1.88)
  other vias: 31.75,49.53
N$171  (via drill 1.02 pad 1.88)
  other vias: 34.29,49.53
N$172  (via drill 1.02 pad 1.88)
  other vias: 39.37,52.07
N$173  (via drill 1.02 pad 1.88)
  other vias: 36.83,52.07
N$174  (via drill 1.02 pad 1.88)
  other vias: 13.97,52.07
N$175  (via drill 1.02 pad 1.88)
  other vias: 16.51,52.07
N$176  (via drill 1.02 pad 1.88)
  other vias: 19.05,52.07
N$177  (via drill 1.02 pad 1.88)
  other vias: 21.59,52.07
N$178  (via drill 1.02 pad 1.88)
  other vias: 24.13,52.07
N$179  (via drill 1.02 pad 1.88)
  other vias: 26.67,52.07
N$180  (via drill 1.02 pad 1.88)
  other vias: 29.21,52.07
N$181  (via drill 1.02 pad 1.88)
  other vias: 31.75,52.07
N$182  (via drill 1.02 pad 1.88)
  other vias: 34.29,52.07
N$183  (via drill 1.02 pad 1.88)
  other vias: 39.37,54.61
N$188  (via drill 1.02 pad 1.88)
  other vias: 36.83,54.61
N$189  (via drill 1.02 pad 1.88)
  other vias: 13.97,54.61
N$190  (via drill 1.02 pad 1.88)
  other vias: 16.51,54.61
N$191  (via drill 1.02 pad 1.88)
  other vias: 19.05,54.61
N$192  (via drill 1.02 pad 1.88)
  other vias: 21.59,54.61
N$193  (via drill 1.02 pad 1.88)
  other vias: 24.13,54.61
N$194  (via drill 1.02 pad 1.88)
  other vias: 26.67,54.61
N$195  (via drill 1.02 pad 1.88)
  other vias: 29.21,54.61
N$196  (via drill 1.02 pad 1.88)
  other vias: 31.75,54.61
N$197  (via drill 1.02 pad 1.88)
  other vias: 34.29,54.61
N$198  (via drill 1.02 pad 1.88)
  other vias: 39.37,57.15
N$199  (via drill 1.02 pad 1.88)
  other vias: 36.83,57.15
N$200  (via drill 1.02 pad 1.88)
  other vias: 13.97,57.15
N$201  (via drill 1.02 pad 1.88)
  other vias: 16.51,57.15
N$202  (via drill 1.02 pad 1.88)
  other vias: 19.05,57.15
N$203  (via drill 1.02 pad 1.88)
  other vias: 21.59,57.15
N$204  (via drill 1.02 pad 1.88)
  other vias: 24.13,57.15
N$205  (via drill 1.02 pad 1.88)
  other vias: 26.67,57.15
N$206  (via drill 1.02 pad 1.88)
  other vias: 29.21,57.15
N$207  (via drill 1.02 pad 1.88)
  other vias: 31.75,57.15
N$208  (via drill 1.02 pad 1.88)
  other vias: 34.29,57.15
NC1
  Top 0.254: JP2.1 JP7.1
NC2
  Bottom 0.254: JP2.6 JP7.6
RESET
  Top 0.254: JP8.RES JP11.6 8.89,41.91 9.53,41.27 9.53,13.34 11.43,11.43 25.34,11.43 ICSP.5
  Bottom 0.254: S4.3 6.27,50.09 5.08,48.9 5.08,42.55 4.45,41.91 JP8.RES
RX
  Top 0.254: JP12.1 JP8.RX
  Bottom 0.254: SJ2.2 38.73,59.69 40.01,58.42 43.18,58.42 43.81,57.78 43.81,12.7 45.09,11.43 JP12.1 46.35,11.43
RX-I  (via drill 0.38)
  Top 0.254: v22.61,64.77 19.05,64.77 JP2.5 JP7.5
  Bottom 0.254: v22.61,64.77 29.59,64.77 32.13,62.23 SJ1.1
SCL
  Top 0.254: JP1.10 JP8.SCL
SDA
  Top 0.254: JP1.9 JP8.SDA
TX
  Top 0.254: JP12.2 JP8.TX
  Bottom 0.254: SJ1.2 43.18,62.23 48.26,57.15 48.26,14.61 48.9,13.97 JP8.TX
TX-O
  Bottom 0.254: SJ2.1 32.26,59.69 31.11,60.83 31.11,62.48 29.72,63.88 21.59,63.88 | 21.59,63.88 JP7.4 | JP2.4 21.59,63.88
VCC  (via drill 0.38)
  Top 0.254: JP2.2 JP7.2 24.89,60.58 18.03,60.58 v17.14,59.69
  Bottom 0.254: SJ4.1 v17.14,59.69
VIN
  Top 0.254: JP11.1 JP8.VIN

### Text on the board
Bottom: v31
tPlace: RXI | TXO | GND | VCC | 5V | D1 | D0 | GND | 5V | Arduino / ProtoShield | GND | Reset | SCL | SDA | REF | GND | NC | D13 | IOR | D12 | RST | D11 | 3.3 | D10 | 5V | D9 | GND | D8 | GND | RAW | D7 | D6 | A0 | D5 | A1 | D4 | A2 | D3 | A3 | D2 | A4 | D1 | 5V | GND | A5 | 1 | D0 | LED1 | - | LED2 | LED2 | LED1 | SW2 | + | SW2 | 330 | 10k | 330
bPlace: BlueSMiRF | TX | 5V | 5V | GND | RX | GND | SCL | SDA | REF | GND | NC | D13 | IOR | D12 | RST | D11 | 3.3 | D10 | 5V | D9 | GND | D8 | GND | RAW | D7 | D6 | A0 | D5 | A1 | D4 | A2 | D3 | A3 | D2 | A4 | D1 | 5V | GND | A5 | D0 | LED2 | LED1 | SW2
tNames: Digital | 1
Measures: Units: Inches
tDocu: Nathan Seidle | Toni Klopfenstein & Ho Yun "Bobby" Chan